# EAGLE schematic Demux (EAGLE 7.7.0)
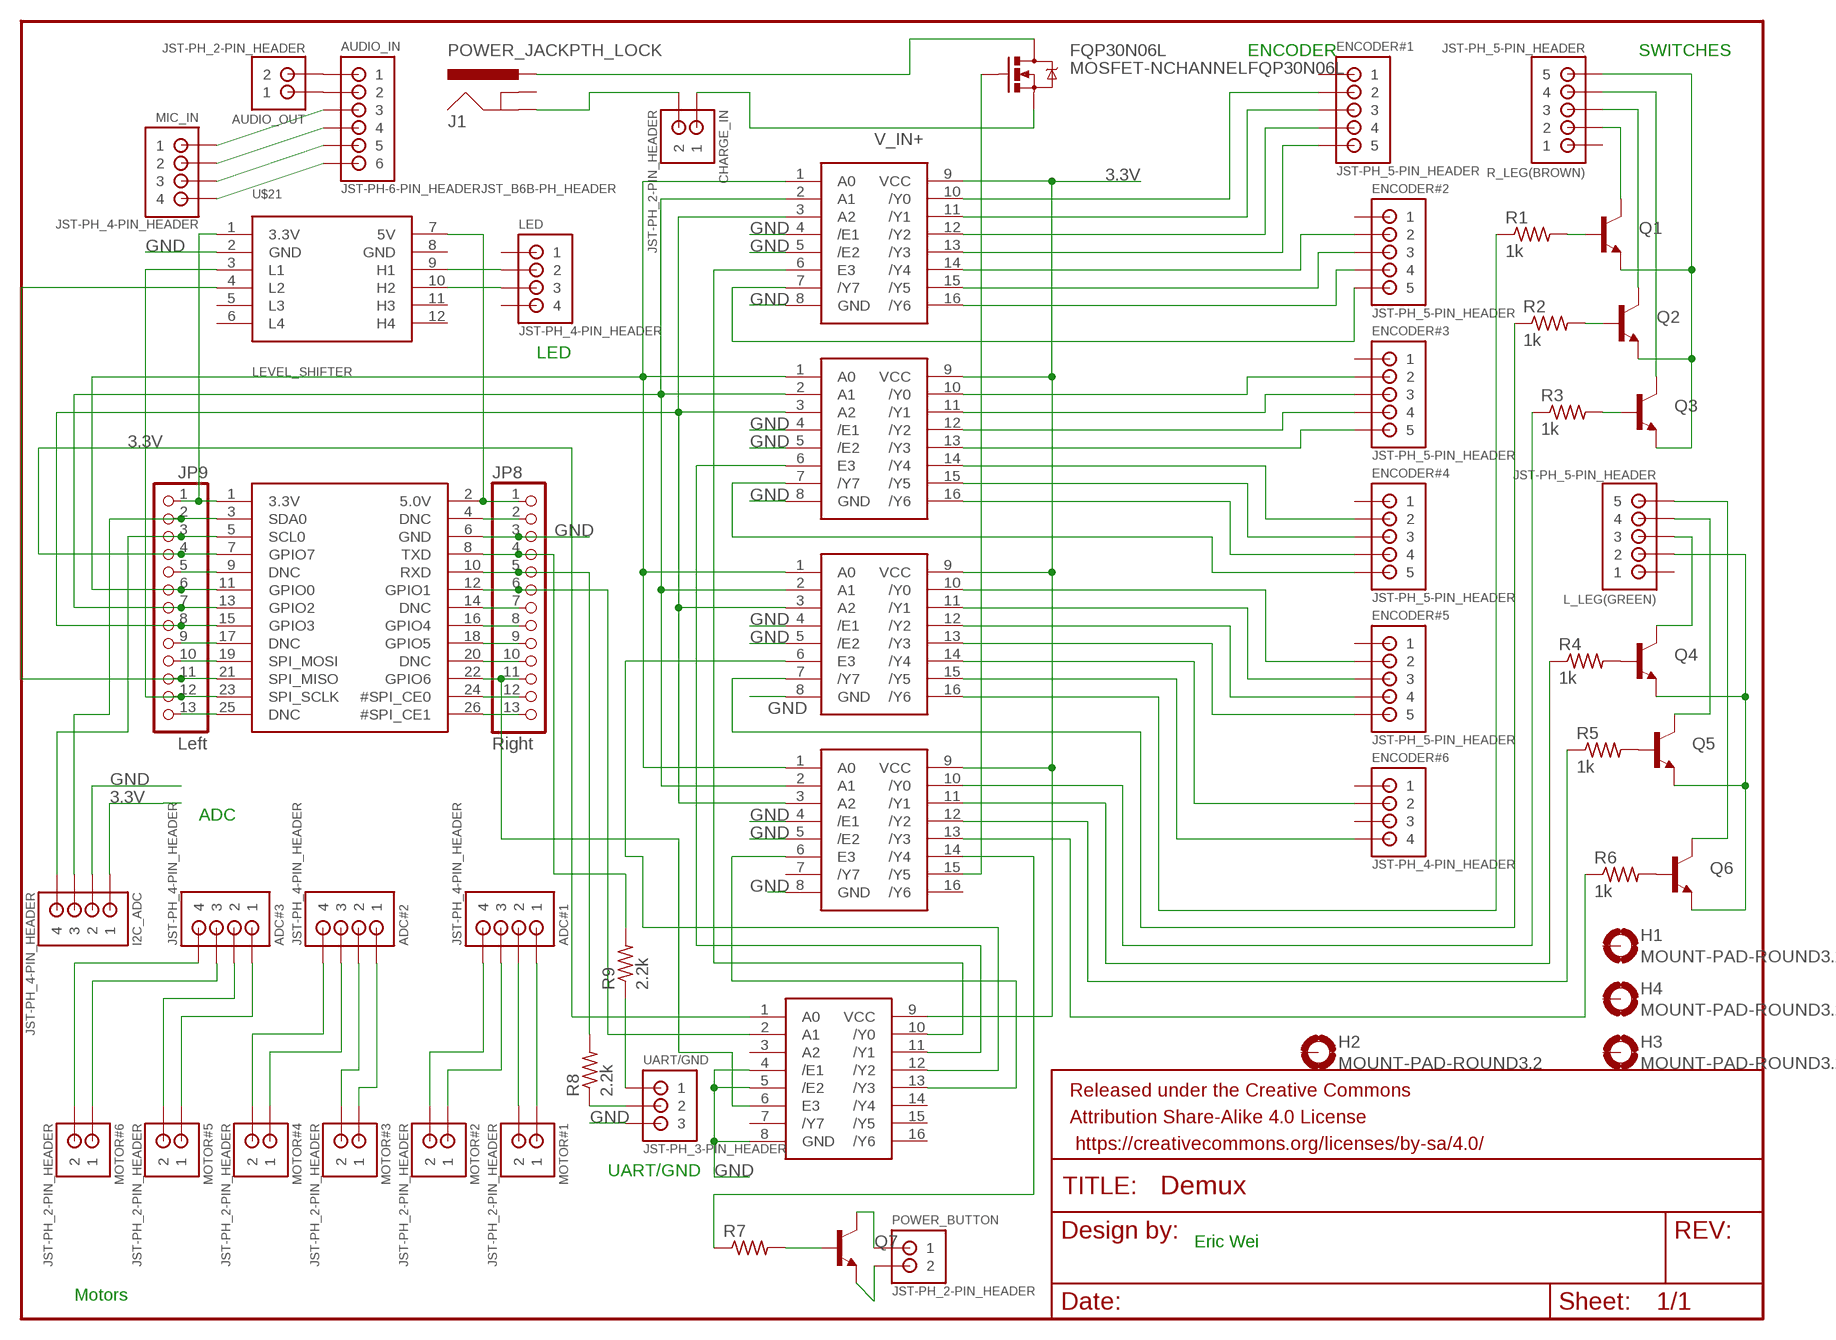
[diagram p0: schematic, sheet 1]

## Parts
ADC#1  JST-PH_4-PIN_HEADER  [JST_B4B-PH_HEADER]
ADC#2  JST-PH_4-PIN_HEADER  [JST_B4B-PH_HEADER]
ADC#3  JST-PH_4-PIN_HEADER  [JST_B4B-PH_HEADER]
AUDIO_IN  JST-PH-6-PIN_HEADERJST_B6B-PH_HEADER  [JST_B6B-PH_HEADER]
AUDIO_OUT  JST-PH_2-PIN_HEADER  [JST_B2B-PH_HEADER]
CHARGE_IN  JST-PH_2-PIN_HEADER  [JST_B2B-PH_HEADER]
ENCODER#1  JST-PH_5-PIN_HEADER  [JST_B5B-PH_HEADER]
ENCODER#2  JST-PH_5-PIN_HEADER  [JST_B5B-PH_HEADER]
ENCODER#3  JST-PH_5-PIN_HEADER  [JST_B5B-PH_HEADER]
ENCODER#4  JST-PH_5-PIN_HEADER  [JST_B5B-PH_HEADER]
ENCODER#5  JST-PH_5-PIN_HEADER  [JST_B5B-PH_HEADER]
ENCODER#6  JST-PH_4-PIN_HEADER  [JST_B4B-PH_HEADER]
FQP30N06L  MOSFET-NCHANNELFQP30N06L  [TO220V]
FRAME1  FRAME-LETTER  [CREATIVE_COMMONS]
H1  MOUNT-PAD-ROUND3.2  [3,2-PAD]
H2  MOUNT-PAD-ROUND3.2  [3,2-PAD]
H3  MOUNT-PAD-ROUND3.2  [3,2-PAD]
H4  MOUNT-PAD-ROUND3.2  [3,2-PAD]
I2C_ADC  JST-PH_4-PIN_HEADER  [JST_B4B-PH_HEADER]
J1  POWER_JACKPTH_LOCK  [POWER_JACK_PTH_LOCK]
JP7  PI  RASBERRYPI_IDC  [RASBERRYPI_IDC]
JP8  Right  HEADER-1X1380MIL  [1X13_ROUND_76MIL]
JP9  Left  HEADER-1X1380MIL  [1X13_ROUND_76MIL]
L_LEG(GREEN)  JST-PH_5-PIN_HEADER  [JST_B5B-PH_HEADER]
LED  JST-PH_4-PIN_HEADER  [JST_B4B-PH_HEADER]
MIC_IN  JST-PH_4-PIN_HEADER  [JST_B4B-PH_HEADER]
MOTOR#1  JST-PH_2-PIN_HEADER  [JST_B2B-PH_HEADER]
MOTOR#2  JST-PH_2-PIN_HEADER  [JST_B2B-PH_HEADER]
MOTOR#3  JST-PH_2-PIN_HEADER  [JST_B2B-PH_HEADER]
MOTOR#4  JST-PH_2-PIN_HEADER  [JST_B2B-PH_HEADER]
MOTOR#5  JST-PH_2-PIN_HEADER  [JST_B2B-PH_HEADER]
MOTOR#6  JST-PH_2-PIN_HEADER  [JST_B2B-PH_HEADER]
POWER_BUTTON  JST-PH_2-PIN_HEADER  [JST_B2B-PH_HEADER]
Q1  TRANSISTOR_NPN2N3904  [TO-92]
Q2  TRANSISTOR_NPN2N3904  [TO-92]
Q3  TRANSISTOR_NPN2N3904  [TO-92]
Q4  TRANSISTOR_NPN2N3904  [TO-92]
Q5  TRANSISTOR_NPN2N3904  [TO-92]
Q6  TRANSISTOR_NPN2N3904  [TO-92]
Q7  TRANSISTOR_NPN2N3904  [TO-92]
R1  1k  R-US_0207/5V  [0207/5V]
R2  1k  R-US_0207/5V  [0207/5V]
R3  1k  R-US_0207/5V  [0207/5V]
R4  1k  R-US_0207/5V  [0207/5V]
R5  1k  R-US_0207/5V  [0207/5V]
R6  1k  R-US_0207/5V  [0207/5V]
R7  R-US_0207/5V  [0207/5V]
R8  2.2k  R-US_0207/5V  [0207/5V]
R9  2.2k  R-US_0207/5V  [0207/5V]
R_LEG(BROWN)  JST-PH_5-PIN_HEADER  [JST_B5B-PH_HEADER]
U$1  74LVC138ADDIL16  [DIL16]
U$2  74LVC138ADDIL16  [DIL16]
U$3  74LVC138ADDIL16  [DIL16]
U$4  74LVC138ADDIL16  [DIL16]
U$5  74LVC138ADDIL16  [DIL16]
U$21  LEVEL_SHIFTER  [LEVEL_SHIFTER]
UART/GND  JST-PH_3-PIN_HEADER  [JST_B3B-PH_HEADER]

## Nets
3.3V: I2C_ADC.P1 JP7.1(3.3V) JP9.1 U$1.9(VCC) U$2.9(VCC) U$3.9(VCC) U$4.9(VCC) U$5.9(VCC) U$21.1(3.3V)
5.0V: JP7.2(5.0V) JP8.1 U$21.7(5V)
GND: I2C_ADC.P2 JP7.6(GND) JP8.3 U$1.4(/E1) U$1.5(/E2) U$1.8(GND) U$2.4(/E1) U$2.5(/E2) U$2.8(GND) U$3.4(/E1) U$3.5(/E2) U$3.8(GND) U$4.4(/E1) U$4.5(/E2) U$4.8(GND) U$5.4(/E1) U$5.5(/E2) U$5.8(GND) U$21.2(GND) UART/GND.P3
N$1: JP7.11(GPIO0) JP9.6 U$1.1(A0) U$2.1(A0) U$3.1(A0) U$4.1(A0)
N$2: JP7.13(GPIO2) JP9.7 U$1.2(A1) U$2.2(A1) U$3.2(A1) U$4.2(A1)
N$3: JP7.15(GPIO3) JP9.8 U$1.3(A2) U$2.3(A2) U$3.3(A2) U$4.3(A2)
N$4: ENCODER#1.P2 U$1.10(/Y0)
N$5: ENCODER#1.P3 U$1.11(/Y1)
N$6: ENCODER#1.P4 U$1.12(/Y2)
N$7: ENCODER#1.P5 U$1.13(/Y3)
N$8: ENCODER#2.P2 U$1.14(/Y4)
N$9: ENCODER#2.P3 U$1.15(/Y5)
N$10: ENCODER#2.P4 U$1.16(/Y6)
N$11: ENCODER#2.P5 U$1.7(/Y7)
N$12: ENCODER#3.P2 U$2.10(/Y0)
N$13: ENCODER#3.P3 U$2.11(/Y1)
N$14: ENCODER#3.P4 U$2.12(/Y2)
N$15: ENCODER#3.P5 U$2.13(/Y3)
N$16: ENCODER#4.P2 U$2.14(/Y4)
N$17: ENCODER#4.P3 U$2.15(/Y5)
N$18: ENCODER#4.P4 U$2.16(/Y6)
N$19: ENCODER#4.P5 U$2.7(/Y7)
N$20: ENCODER#5.P2 U$3.10(/Y0)
N$21: ENCODER#5.P3 U$3.11(/Y1)
N$22: ENCODER#5.P4 U$3.12(/Y2)
N$23: ENCODER#5.P5 U$3.13(/Y3)
N$24: ENCODER#6.P2 U$3.14(/Y4)
N$25: ENCODER#6.P4 U$3.15(/Y5)
N$26: R2.1 U$3.7(/Y7)
N$27: ADC#1.P1 MOTOR#1.P1
N$28: ADC#1.P2 MOTOR#1.P2
N$29: ADC#1.P3 MOTOR#2.P1
N$30: ADC#1.P4 MOTOR#2.P2
N$31: ADC#2.P1 MOTOR#3.P1
N$32: ADC#2.P2 MOTOR#3.P2
N$33: ADC#2.P3 MOTOR#4.P1
N$34: ADC#2.P4 MOTOR#4.P2
N$35: ADC#3.P1 MOTOR#5.P1
N$36: ADC#3.P2 MOTOR#5.P2
N$37: ADC#3.P3 MOTOR#6.P1
N$38: ADC#3.P4 MOTOR#6.P2
N$39: Q1.2(B) R1.2
N$40: Q3.2(B) R3.2
N$41: Q2.2(B) R2.2
N$42: Q4.2(B) R4.2
N$43: Q5.2(B) R5.2
N$44: Q6.2(B) R6.2
N$45: R1.1 U$3.16(/Y6)
N$46: R3.1 U$4.10(/Y0)
N$47: R4.1 U$4.11(/Y1)
N$48: R5.1 U$4.12(/Y2)
N$49: Q1.1(E) Q2.1(E) Q3.1(E) R_LEG(BROWN).P5
N$50: R6.1 U$4.13(/Y3)
N$51: AUDIO_IN.P3 MIC_IN.P1
N$52: I2C_ADC.P4 JP7.5(SCL0) JP9.3
N$53: JP7.7(GPIO7) JP9.4 U$5.1(A0)
N$54: JP7.9(DNC) JP9.5
N$55: L_LEG(GREEN).P2 Q4.1(E) Q5.1(E) Q6.1(E)
N$56: L_LEG(GREEN).P3 Q4.3(C)
N$57: Q1.3(C) R_LEG(BROWN).P2
N$58: JP7.17(DNC) JP9.9
N$59: JP7.19(SPI_MOSI) JP9.10
N$60: JP7.18(GPIO5) JP8.9
N$61: JP7.23(SPI_SCLK) JP9.12 U$21.3(L1)
N$62: JP7.25(DNC) JP9.13
N$63: JP7.4(DNC) JP8.2
N$64: Q2.3(C) R_LEG(BROWN).P3
N$65: JP7.10(RXD) JP8.5 R8.2
N$66: JP7.12(GPIO1) JP8.6 U$5.2(A1)
N$67: JP7.14(DNC) JP8.7
N$68: JP7.16(GPIO4) JP8.8
N$70: JP7.20(DNC) JP8.10
N$71: JP7.22(GPIO6) JP8.11 U$5.6(E3)
N$72: JP7.24(#SPI_CE0) JP8.12
N$73: JP7.26(#SPI_CE1) JP8.13
N$74: L_LEG(GREEN).P4 Q5.3(C)
N$75: L_LEG(GREEN).P5 Q6.3(C)
N$76: I2C_ADC.P3 JP7.3(SDA0) JP9.2
N$77: AUDIO_IN.P4 MIC_IN.P2
N$78: Q7.2(B) R7.2
N$79: POWER_BUTTON.P1 Q7.3(C)
N$80: POWER_BUTTON.P2 Q7.1(E)
N$81: R7.1 U$4.14(/Y4)
N$82: CHARGE_IN.P2 J1.GND
N$83: FQP30N06L.2(D) J1.PWR
N$84: FQP30N06L.1(G) U$4.15(/Y5)
N$85: AUDIO_IN.P2 AUDIO_OUT.P1
N$86: AUDIO_IN.P1 AUDIO_OUT.P2
N$87: U$1.6(E3) U$5.10(/Y0)
N$88: U$2.6(E3) U$5.11(/Y1)
N$89: U$3.6(E3) U$5.12(/Y2)
N$90: Q3.3(C) R_LEG(BROWN).P4
N$91: U$4.6(E3) U$5.13(/Y3)
N$92: JP7.8(TXD) JP8.4 R9.2
N$93: AUDIO_IN.P5 MIC_IN.P3
N$94: AUDIO_IN.P6 MIC_IN.P4
N$95: LED.P2 U$21.9(H1)
N$96: LED.P3 U$21.10(H2)
N$97: R8.1 UART/GND.P2
N$98: R9.1 UART/GND.P1
N$100: JP7.21(SPI_MISO) JP9.11 U$21.4(L2)
V_IN+: CHARGE_IN.P1 FQP30N06L.3(S)
Unconnected: ENCODER#1.P1 ENCODER#2.P1 ENCODER#3.P1 ENCODER#4.P1 ENCODER#5.P1 ENCODER#6.P1 ENCODER#6.P3 H1.B3,2(MOUNT) H2.B3,2(MOUNT) H3.B3,2(MOUNT) H4.B3,2(MOUNT) J1.GNDBREAK L_LEG(GREEN).P1 LED.P1 LED.P4 R_LEG(BROWN).P1 U$4.7(/Y7) U$4.16(/Y6) U$5.3(A2) U$5.7(/Y7) U$5.14(/Y4) U$5.15(/Y5) U$5.16(/Y6) U$21.5(L3) U$21.6(L4) U$21.11(H3) U$21.12(H4)

## Notes on the sheet
- ENCODER | SWITCHES
- LED
- ADC
- UART/GND
- Eric Wei
- Motors

## Power pins joined to a net without a drawn wire
GND: U$21.8(GND)

## Library data of the parts
ADC#1-ADC#3 ENCODER#6 I2C_ADC LED MIC_IN = SRG:JST-PH_4-PIN_HEADER: 4-pin JST PH Shrouded Header, top entry P/N B4B-PH-K-S Mating connector PHR-4 Mating cable assembly: Sparkfun PRT-09916 <http://www.sparkfun.com/products/9916>
AUDIO_IN = JST_Connectors:JST-PH-6-PIN_HEADER: 6-PIN JST PH Shrouded Header
AUDIO_OUT CHARGE_IN MOTOR#1-MOTOR#6 POWER_BUTTON = SRG:JST-PH_2-PIN_HEADER: 2-pin JST PH Shrouded Header, top entry P/N B2B-PH-K-S Mating connector PHR-2 Mating cable assembly: Sparkfun PRT-09914 <http://www.sparkfun.com/products/9914>
ENCODER#1-ENCODER#5 L_LEG(GREEN) R_LEG(BROWN) = SRG:JST-PH_5-PIN_HEADER: 5-pin JST PH Shrouded Header, top entry P/N B5B-PH-K-S Mating connector PHR-5 Mating cable assembly: Sparkfun PRT-09917 <http://www.sparkfun.com/products/9917>
FQP30N06L = SparkFun-DiscreteSemi:MOSFET-NCHANNEL: Common NMOSFET Parts MFG P/N Store ID Prod ID FDD8780 TRANS-09984 SI7820DN TRANS-11055 FDS6630A IC-08089 2N7002PW TRANS-11151 FQP30N06L COM-10213 TRANS-10060 BSS123LT1G TRANS-08345 BSS138 TRANS-00830 BS170 2N7000; PROD_ID: TRANS-10060
FRAME1 = SparkFun-Aesthetics:FRAME-LETTER: Schematic Frame Standard 8.5x11 US Letter frame
H1-H4 = holes:MOUNT-PAD-ROUND: MOUNTING PAD, round
J1 = SparkFun-Connectors:POWER_JACK: Power Jack This is the standard 5.5mm barrel jack for power. The PTH is the most common, proven, reliable, footprint. The Slot footprint only works if the mill layer is transmitted to the PCB fab house so be warned. Mating wall wart : TOL-00298 (and others); PROD_ID: CONN-08197; SF_ID: PRT-00119
JP7 = microbuilder:RASBERRYPI_IDC: Rasberry PI IDC Header
JP8 JP9 = microbuilder:HEADER-1X13
Q1-Q7 = SparkFun-DiscreteSemi:TRANSISTOR_NPN: Generic NPN BJT MMBT2222A - TRANS-08049 (SOT-23, 1A 40V) MPSA42 - TRANS-09116 (SOT-23, 500mA 300V) MMBT5088LT1G - TRANS-11160 (SOT-23, 50 mA 30V) BC547 - COM-08928 <http://www.sparkfun.com/products/8928> (TO-92 45V 100mA) (1.Collector 2.Base 3.Emitter) 2N3904 - COM-00521 <http://www.sparkfun.com/products/521> (TO-92 40V 200mA) (1.Emitter 2.Base 3.Collector) P2N2222A - COM-12852 <http://www.sparkfun.com/products/12852> (TO-92 40V 600mA) (1.Collector 2.Base 3.Emitter); PROD_ID: TRANS-08447
R1-R9 = resistor:R-US_: RESISTOR, American symbol
U$1-U$5 = SparkFun-DigitalIC:74LVC138AD: 3-to-8 decoder
U$21 = SparkFun-Connectors:LEVEL_SHIFTER
UART/GND = SRG:JST-PH_3-PIN_HEADER: 3-pin JST PH Shrouded Header, top entry P/N B3B-PH-K-S Mating connector PHR-3